# Altium project DPT2.3.PrjPcb
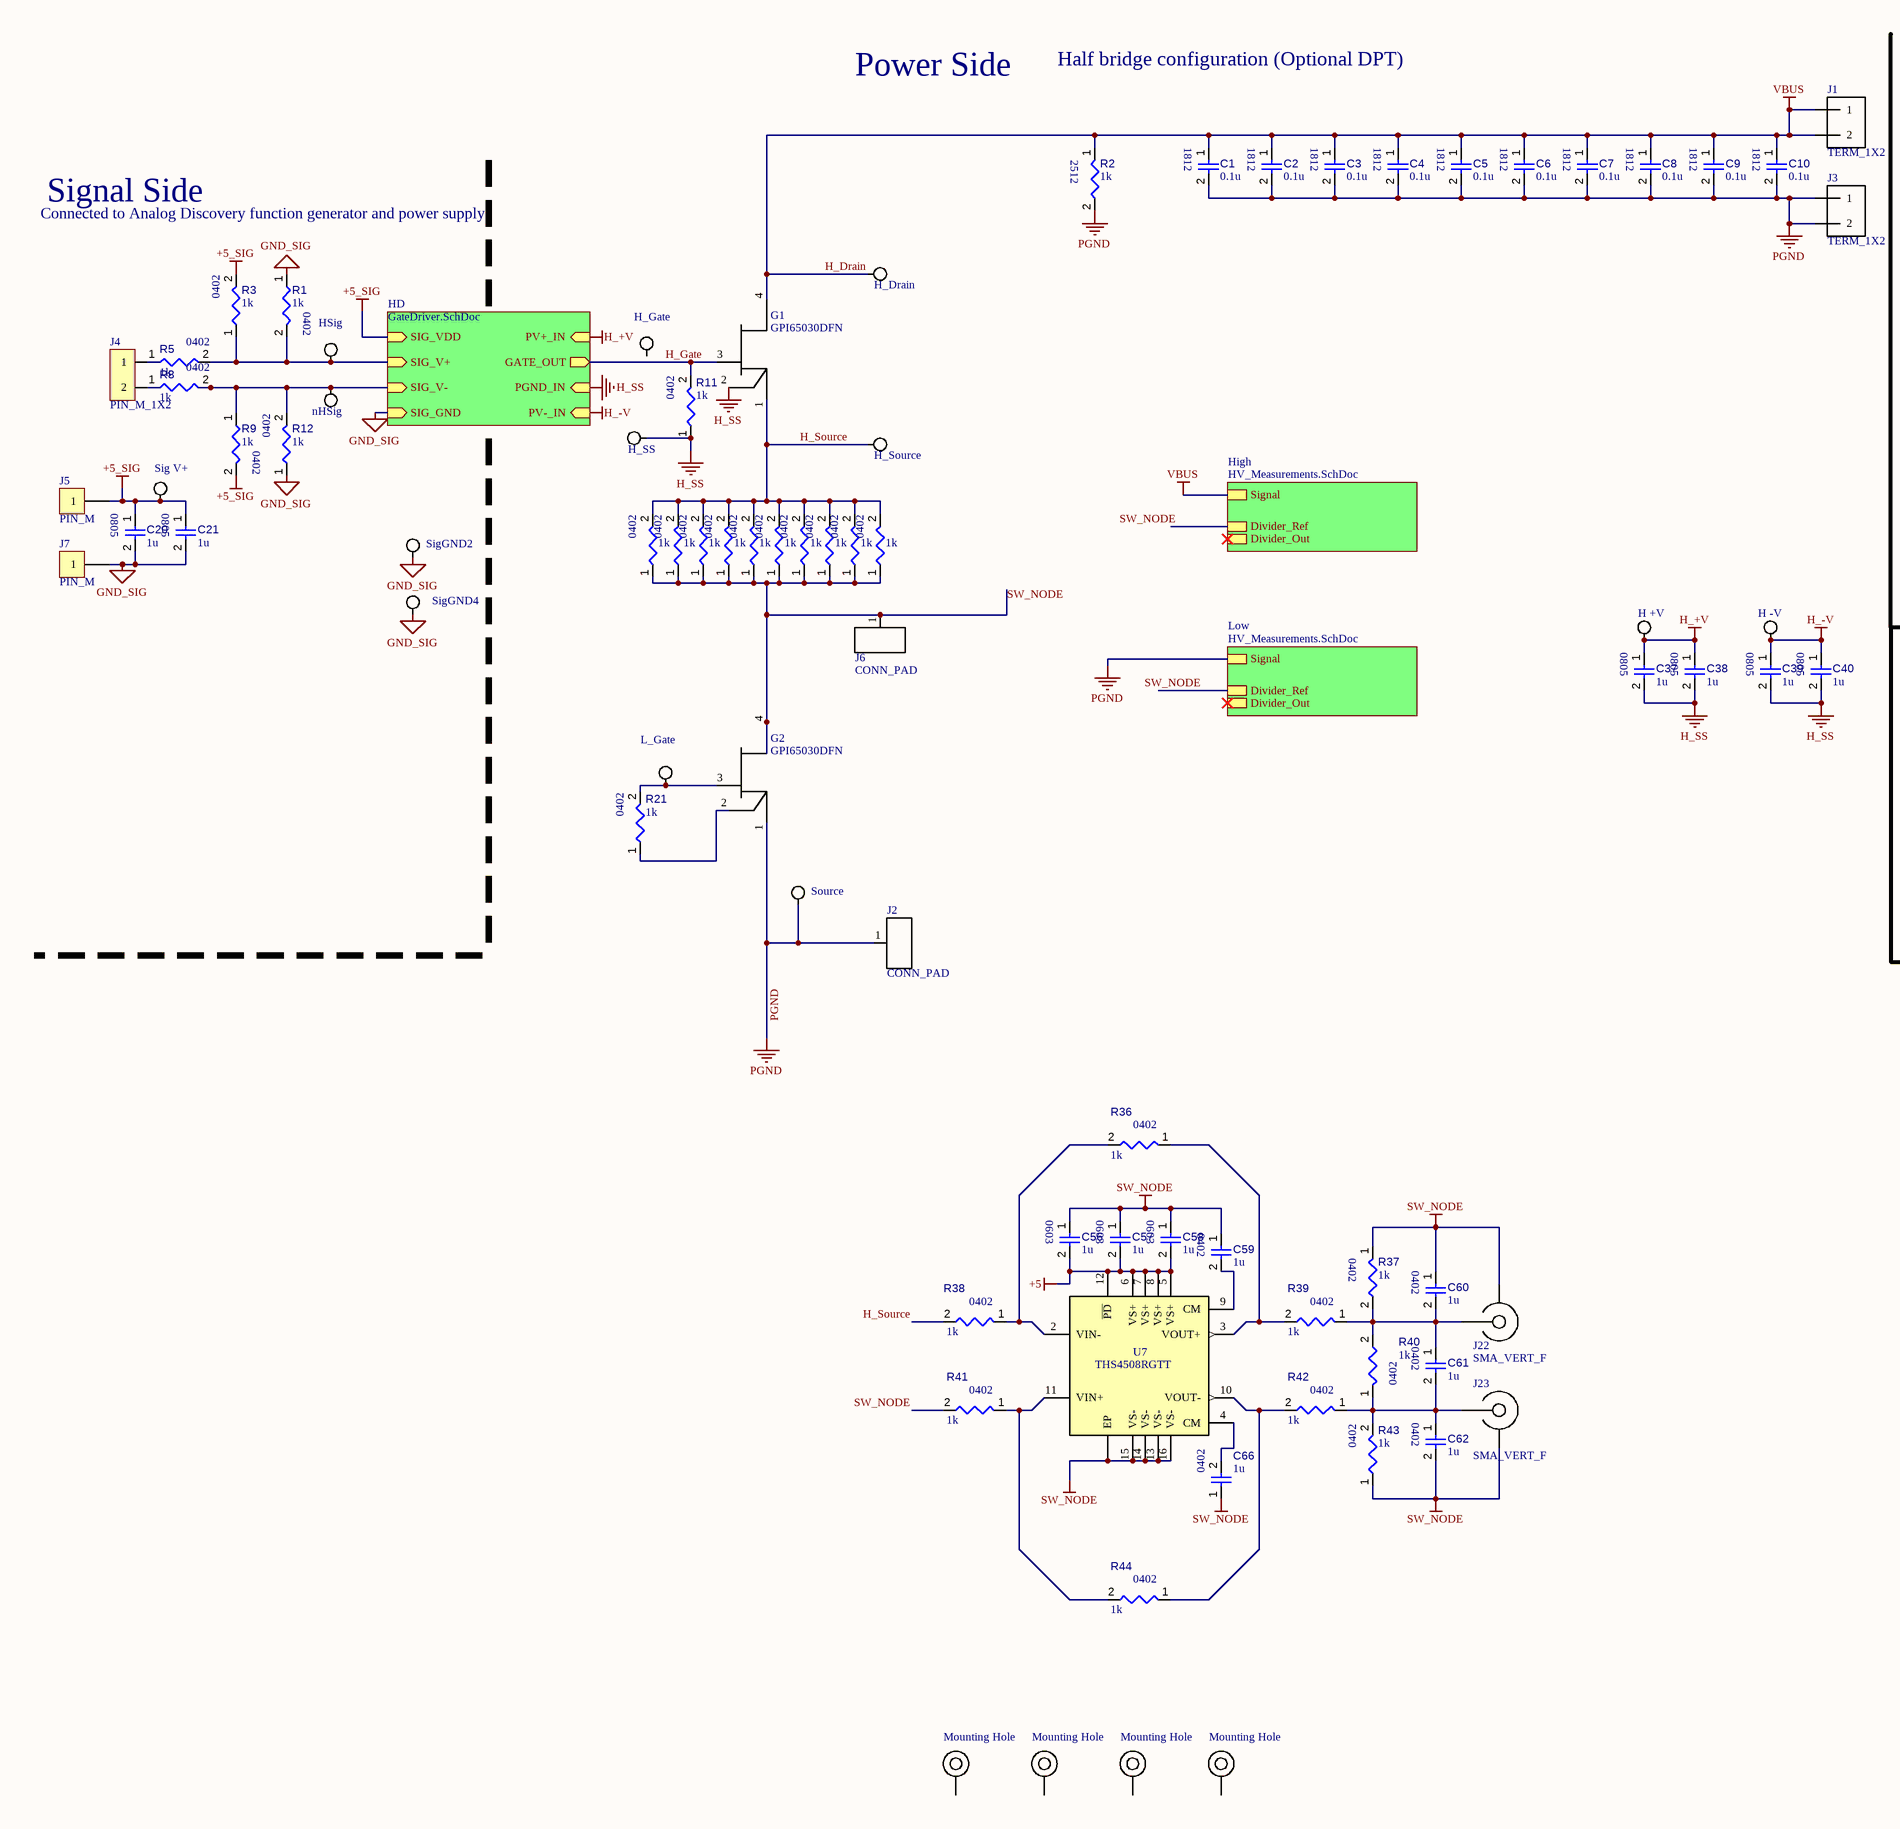
[diagram p0: DPT2.3.SchDoc, left]
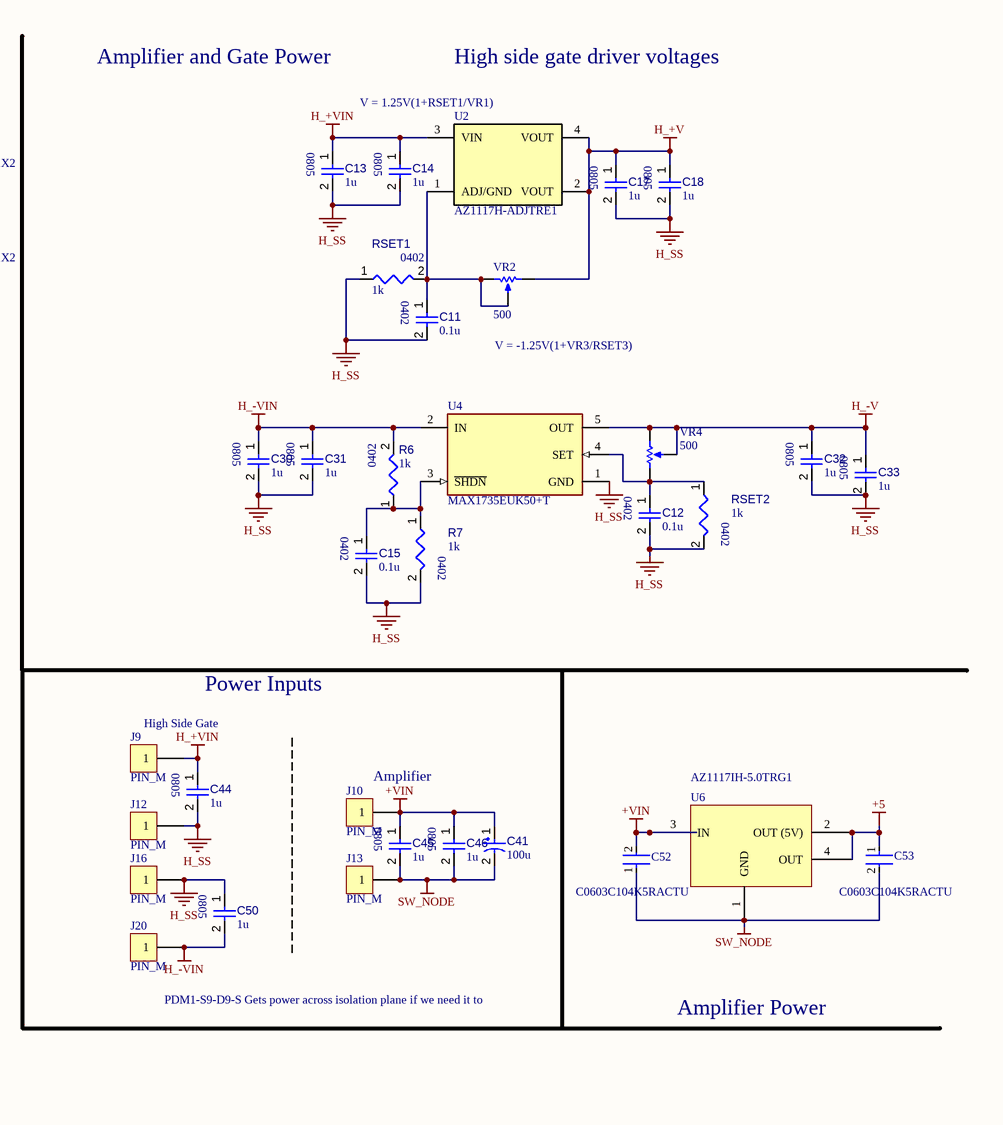
[diagram p1: DPT2.3.SchDoc, right]
3 sheets, 139 parts. Net scope: hierarchical (ports join the sheet entries above them; power ports are global).
Board file: DPT2.3.PcbDoc
Sheets:
  DPT2.3.SchDoc
    High = HV_Measurements.SchDoc
    Low = HV_Measurements.SchDoc
    HD = GateDriver.SchDoc

## Sheet DPT2.3.SchDoc
size A2; SheetNumber: 1; SheetTotal: 3

### Parts
C1  value 0.1u  [CAP_1812]  (hidden comment: CAP-1812)
C2  value 0.1u  [CAP_1812]  (hidden comment: CAP-1812)
C3  value 0.1u  [CAP_1812]  (hidden comment: CAP-1812)
C4  value 0.1u  [CAP_1812]  (hidden comment: CAP-1812)
C5  value 0.1u  [CAP_1812]  (hidden comment: CAP-1812)
C6  value 0.1u  [CAP_1812]  (hidden comment: CAP-1812)
C7  value 0.1u  [CAP_1812]  (hidden comment: CAP-1812)
C8  value 0.1u  [CAP_1812]  (hidden comment: CAP-1812)
C9  value 0.1u  [CAP_1812]  (hidden comment: CAP-1812)
C10  value 0.1u  [CAP_1812]  (hidden comment: CAP-1812)
C11  value 0.1u  [CAP_0402_HIGH]  (hidden comment: CAP-0402)
C12  value 0.1u  [CAP_0402_HIGH]  (hidden comment: CAP-0402)
C13  value 1u  [CAP_0805_MED]  (hidden comment: CAP-0805)
C14  value 1u  [CAP_0805_MED]  (hidden comment: CAP-0805)
C15  value 0.1u  [CAP_0402_HIGH]  (hidden comment: CAP-0402)
C17  value 1u  [CAP_0805_MED]  (hidden comment: CAP-0805)
C18  value 1u  [CAP_0805_MED]  (hidden comment: CAP-0805)
C20  value 1u  [CAP_0805_MED]  (hidden comment: CAP-0805)
C21  value 1u  [CAP_0805_MED]  (hidden comment: CAP-0805)
C30  value 1u  [CAP_0805_MED]  (hidden comment: CAP-0805)
C31  value 1u  [CAP_0805_MED]  (hidden comment: CAP-0805)
C32  value 1u  [CAP_0805_MED]  (hidden comment: CAP-0805)
C33  value 1u  [CAP_0805_MED]  (hidden comment: CAP-0805)
C37  value 1u  [CAP_0805_MED]  (hidden comment: CAP-0805)
C38  value 1u  [CAP_0805_MED]  (hidden comment: CAP-0805)
C39  value 1u  [CAP_0805_MED]  (hidden comment: CAP-0805)
C40  value 1u  [CAP_0805_MED]  (hidden comment: CAP-0805)
C41  value 100u  [PCAP_2MM_5MM]  (hidden comment: PCAP-2MMx5MM)
C44  value 1u  [CAP_0805_MED]  (hidden comment: CAP-0805)
C45  value 1u  [CAP_0805_MED]  (hidden comment: CAP-0805)
C46  value 1u  [CAP_0805_MED]  (hidden comment: CAP-0805)
C50  value 1u  [CAP_0805_MED]  (hidden comment: CAP-0805)
C52  C0603C104K5RACTU  [FP-C0603C-CF-IPC_B]
C53  C0603C104K5RACTU  [FP-C0603C-CF-IPC_B]
C56  value 1u  [CAP_0603_HIGH]  (hidden comment: CAP-0603)
C57  value 1u  [CAP_0603_HIGH]  (hidden comment: CAP-0603)
C58  value 1u  [CAP_0603_HIGH]  (hidden comment: CAP-0603)
C59  value 1u  [CAP_0402_HIGH]  (hidden comment: CAP-0402)
C60  value 1u  [CAP_0402_HIGH]  (hidden comment: CAP-0402)
C61  value 1u  [CAP_0402_HIGH]  (hidden comment: CAP-0402)
C62  value 1u  [CAP_0402_HIGH]  (hidden comment: CAP-0402)
C66  value 1u  [CAP_0402_HIGH]  (hidden comment: CAP-0402)
G1  GPI65030DFN  [DFN_8X8]
G2  GPI65030DFN  [DFN_8X8]
H_+V  Testpoint  [Testpoint-Footprint-1]  (value not drawn)
H_-V  Testpoint  [Testpoint-Footprint-1]  (value not drawn)
H_Drain  Testpoint  [Testpoint-Footprint-1]  (value not drawn)
H_Gate  Testpoint  [Testpoint-Footprint-1]  (value not drawn)
H_Source  Testpoint  [Testpoint-Footprint-1]  (value not drawn)
H_SS  Testpoint  [Testpoint-Footprint-1]  (value not drawn)
HSig  Testpoint  [Testpoint-Footprint-1]  (value not drawn)
J1  TERM_1X2  [J_TERM_BLK_1X2]
J2  CONN_PAD  [CONN_PAD]
J3  TERM_1X2  [J_TERM_BLK_1X2]
J4  PIN_M_1X2  [J_THT_2.54MM_1X2]
J5  PIN_M  [J_THT_1_PIN]
J6  CONN_PAD  [CONN_PAD]
J7  PIN_M  [J_THT_1_PIN]
J9  PIN_M  [J_THT_1_PIN]
J10  PIN_M  [J_THT_1_PIN]
J12  PIN_M  [J_THT_1_PIN]
J13  PIN_M  [J_THT_1_PIN]
J16  PIN_M  [J_THT_1_PIN]
J20  PIN_M  [J_THT_1_PIN]
J22  SMA_VERT_F  [SMA_VERT_F]
J23  SMA_VERT_F  [SMA_VERT_F]
L_Gate  Testpoint  [Testpoint-Footprint-1]  (value not drawn)
MH1  Mounting Hole  [Mounting Hole-Footprint-1]
MH2  Mounting Hole  [Mounting Hole-Footprint-1]
MH3  Mounting Hole  [Mounting Hole-Footprint-1]
MH4  Mounting Hole  [Mounting Hole-Footprint-1]
nHSig  Testpoint  [Testpoint-Footprint-1]  (value not drawn)
R1  value 1k  [RES_0402_HIGH]  (hidden comment: RES-0402)
R2  value 1k  [RES_2512_MED]  (hidden comment: RES-2512)
R3  value 1k  [RES_0402_HIGH]  (hidden comment: RES-0402)
R4  value 1k  [RES_0402_HIGH]  (hidden comment: RES-0402)
R5  value 1k  [RES_0402_HIGH]  (hidden comment: RES-0402)
R6  value 1k  [RES_0402_HIGH]  (hidden comment: RES-0402)
R7  value 1k  [RES_0402_HIGH]  (hidden comment: RES-0402)
R8  value 1k  [RES_0402_HIGH]  (hidden comment: RES-0402)
R9  value 1k  [RES_0402_HIGH]  (hidden comment: RES-0402)
R10  value 1k  [RES_0402_HIGH]  (hidden comment: RES-0402)
R11  value 1k  [RES_0402_HIGH]  (hidden comment: RES-0402)
R12  value 1k  [RES_0402_HIGH]  (hidden comment: RES-0402)
R21  value 1k  [RES_0402_HIGH]  (hidden comment: RES-0402)
R23  value 1k  [RES_0402_HIGH]  (hidden comment: RES-0402)
R25  value 1k  [RES_0402_HIGH]  (hidden comment: RES-0402)
R36  value 1k  [RES_0402_HIGH]  (hidden comment: RES-0402)
R37  value 1k  [RES_0402_HIGH]  (hidden comment: RES-0402)
R38  value 1k  [RES_0402_HIGH]  (hidden comment: RES-0402)
R39  value 1k  [RES_0402_HIGH]  (hidden comment: RES-0402)
R40  value 1k  [RES_0402_HIGH]  (hidden comment: RES-0402)
R41  value 1k  [RES_0402_HIGH]  (hidden comment: RES-0402)
R42  value 1k  [RES_0402_HIGH]  (hidden comment: RES-0402)
R43  value 1k  [RES_0402_HIGH]  (hidden comment: RES-0402)
R44  value 1k  [RES_0402_HIGH]  (hidden comment: RES-0402)
R45  value 1k  [RES_0402_HIGH]  (hidden comment: RES-0402)
R46  value 1k  [RES_0402_HIGH]  (hidden comment: RES-0402)
R47  value 1k  [RES_0402_HIGH]  (hidden comment: RES-0402)
R49  value 1k  [RES_0402_HIGH]  (hidden comment: RES-0402)
R50  value 1k  [RES_0402_HIGH]  (hidden comment: RES-0402)
R53  value 1k  [RES_0402_HIGH]  (hidden comment: RES-0402)
RSET1  value 1k  [RES_0402_HIGH]  (hidden comment: RES-0402)
RSET2  value 1k  [RES_0402_HIGH]  (hidden comment: RES-0402)
Sig_V+  Testpoint  [Testpoint-Footprint-1]  (value not drawn)
SigGND2  Testpoint  [Testpoint-Footprint-1]  (value not drawn)
SigGND4  Testpoint  [Testpoint-Footprint-1]  (value not drawn)
Source  Testpoint  [Testpoint-Footprint-1]  (value not drawn)
U2  AZ1117H-ADJTRE1  [SOT-223]
U4  MAX1735EUK50+T  [FP-U5-2-IPC_B]
U6  AZ1117IH-5.0TRG1  [SOT230P700X180-4N]
U7  THS4508RGTT  [QFN-16]
VR2  value 500  [TRIM_J-LEAD]  (hidden comment: RES_POT_JLEAD)
VR4  value 500  [TRIM_J-LEAD]  (hidden comment: RES_POT_JLEAD)

### Sub-sheets
HD = GateDriver.SchDoc: GATE_OUT (out), SIG_V+ (in), SIG_V- (in), SIG_GND (in), SIG_VDD (in), PGND_IN (in), PV+_IN (in), PV-_IN (in)
High = HV_Measurements.SchDoc: Divider_Ref, Divider_Out, Signal
Low = HV_Measurements.SchDoc: Divider_Ref, Divider_Out, Signal

### Nets
+5: C53.1 C56.2 C57.2 C58.2 U6.2(OUT_(5V)) U6.4(OUT) U7.5(VS+) U7.6(VS+) U7.7(VS+) U7.8(VS+) U7.12(~{PD})
+5_SIG: C20.1 C21.1 J5.1 R3.2 R9.2 Sig_V+.1 ; sheet HD/SIG_VDD
+VIN: C41.1 C45.1 C46.1 C52.2 J10.1 U6.3(IN)
GND_SIG: C20.2 C21.2 J7.1 R1.1 R12.1 SigGND2.1 SigGND4.1 ; sheet HD/SIG_GND
H_+V: C17.1 C18.1 C37.1 C38.1 H_+V.1 U2.2(VOUT) U2.4(VOUT) VR2.1(CCW) ; sheet HD/PV+_IN
H_+VIN: C13.1 C14.1 C44.1 J9.1 U2.3(VIN)
H_-V: C32.1 C33.1 C39.1 C40.1 H_-V.1 U4.5(OUT) VR4.2(S) VR4.3(CW) ; sheet HD/PV-_IN
H_-VIN: C30.1 C31.1 C50.2 J20.1 R6.2 U4.2(IN)
H_Drain: C1.1 C2.1 C3.1 C4.1 C5.1 C6.1 C7.1 C8.1 C9.1 C10.1 G1.4(D) H_Drain.1 J1.1 J1.2 R2.1 ; sheet High/Signal  [also labelled VBUS]
H_SS: C11.2 C12.2 C13.2 C14.2 C15.2 C17.2 C18.2 C30.2 C31.2 C32.2 C33.2 C37.2 C38.2 C39.2 C40.2 C44.2 C50.1 G1.2(KS) H_SS.1 J12.1 J16.1 R7.2 R11.1 RSET1.1 RSET2.2 U4.1(GND) ; sheet HD/PGND_IN
PGND: C1.2 C2.2 C3.2 C4.2 C5.2 C6.2 C7.2 C8.2 C9.2 C10.2 G2.1(S) J2.1 J3.1 J3.2 R2.2 Source.1 ; sheet Low/Signal
SW_NODE: C41.2 C45.2 C46.2 C52.1 C53.2 C56.1 C57.1 C58.1 C59.1 C60.1 C62.2 C66.1 G2.4(D) J6.1 J13.1 J22.2 J23.2 R4.1 R10.1 R23.1 R25.1 R37.1 R41.2 R43.1 R45.1 R46.1 R47.1 R49.1 R50.1 R53.1 U6.1(GND) U7.13(VS-) U7.14(VS-) U7.15(VS-) U7.16(VS-) U7.17(EP) ; sheet High/Divider_Ref, sheet Low/Divider_Ref
H_Gate: G1.3(G) R11.2 ; sheet HD/GATE_OUT
H_Source: G1.1(S) H_Source.1 R4.2 R10.2 R23.2 R25.2 R38.2 R45.2 R46.2 R47.2 R49.2 R50.2 R53.2
NetC11_1: C11.1 RSET1.2 U2.1(ADJ/GND) VR2.2(S) VR2.3(CW)
NetC12_1: C12.1 RSET2.1 U4.4(SET) VR4.1(CCW)
NetC15_1: C15.1 R6.1 R7.1 U4.3(~{SHDN})
NetC59_2: C59.2 U7.9(CM)
NetC60_2: C60.2 C61.1 J22.1 R37.2 R39.1 R40.2
NetC61_2: C61.2 C62.1 J23.1 R40.1 R42.1 R43.2
NetC66_2: C66.2 U7.4(CM)
NetG2_2: G2.2(KS) R21.1
NetG2_3: G2.3(G) L_Gate.1 R21.2
NetHSig_1: HSig.1 R1.2 R3.1 R5.2 ; sheet HD/SIG_V+
NetJ4_1: J4.1 R5.1
NetJ4_2: J4.2 R8.1
NetnHSig_1: nHSig.1 R8.2 R9.1 R12.2 ; sheet HD/SIG_V-
NetR36_1: R36.1 R39.2 U7.3(VOUT+)
NetR36_2: R36.2 R38.1 U7.2(VIN-)
NetR41_1: R41.1 R44.2 U7.11(VIN+)
NetR42_2: R42.2 R44.1 U7.10(VOUT-)

Not connected (* = marked no-connect by the designer): H_Gate 1; MH1 1(GND); MH2 1(GND); MH3 1(GND); MH4 1(GND)

### Notes on the sheet
- Power Side
- Half bridge configuration (Optional DPT)
- Amplifier and Gate Power
- (near U2) V = 1.25V(1+RSET1/VR1)
- High side gate driver voltages
- Connected to Analog Discovery function generator and power supply
- Signal Side
- V = -1.25V(1+VR3/RSET3)
- Power Inputs
- (near J9) High Side Gate
- (near J10) Amplifier
- PDM1-S9-D9-S Gets power across isolation plane if we need it to
- Amplifier Power

### Library data of the parts
C1-C10 = CMP-001-00088-2: Non polarized SMD capacitor - 1812 (4532 Metric); Package: 1812
C11 C12 C15 C59-C62 C66 = CMP-001-00083-3: Non polarized SMD capacitor - 0402 (1005 Metric); Package: 0402
C13 C14 C17 C18 C20 C21 C30-C33 C37-C40 C44-C46 C50 = CMP-001-00086-3: Non polarized SMD capacitor - 0805 (1608 Metric); Package: 0805
C41 = CMP-001-00091-1: Polarized THT capacitor - Radial can, 2mm lead spacing, 5mm diameter
C52 C53 = CMP-2006-03061-2: CAP CER 0.1UF 50V X7R 0603; Manufacturer: KEMET; Tolerance: 0.1; Temperature Coefficient: 30ppm/°C; Material: Ceramic; Automotive Grade: Grade 1; Value: 0.10 μF; Temperature: -55°C to +125°C; RoHS: TRUE; Temperature Range High: +125°C; Lead Free: Yes; Octopart: https://octopart.com/c0603c104k5ractu-kemet-139244; Digikey Description: CAP CER 0.1UF 50V X7R 0603; Category: Cap; Package: C0603C-CF; ComponentLink2Description: Datasheet; Temperature Range Low: -55°C; Device Class L1: Passive Components; Voltage Rating: 50 V; Automotive: Yes; Device Class L3: Ceramic Capacitors; ComponentLink2URL: https://api.kemet.com/component-edge/download/datasheet/C0603C100J5GACAUTO.pdf; Capacitance: 0.10 μF; Device Class L2: Capacitors; Manufacturer Part Number: C0603C104K5RACTU; Temperature Characteristic: X7R; Height: 0.87mm
C56-C58 = CMP-001-00084-2: Non polarized SMD capacitor - 0603 (1608 Metric); Package: 0603
G1 G2 = CMP-023-000000-5: 650V 15A GaN Enhancement mode Transistor; pin to pad: 1>1+2+9 2>3 3>4 4>5+6+7+8; Package: DFN8X8
H_+V H_-V H_Drain H_Gate H_Source H_SS HSig L_Gate nHSig Sig_V+ SigGND2 SigGND4 Source = CMP-001-0000-5: testpoint for circuit
J1 J3 = CMP-002-00071-1: Terminal Block 1X2, 6.35mm pitch
J2 J6 = CMP-002-00074-4: Solderable Connection Pad
J4 = CMP-002-00073-2: Male Pin 2.54mm pitch 1X2
J5 J7 J9 J10 J12 J13 J16 J20 = CMP-002-00072-1: Male Pin, 1 Pin
J22 J23 = CMP-025-000000-6: SMA connector, Vertical, Female; pin to pad: 2>2+3+4+5; Package: SMA
MH1-MH4 = CMP-032-000006-1
R1 R3-R12 R21 R23 R25 R36-R47 R49 R50 R53 RSET1 RSET2 = CMP-009-00177-2: SMD Resistor - 0402 (1005 Metric); Package: 0402
R2 = CMP-009-00182-3: SMD Resistor - 2512 (6432 Metric); Package: 2512
U2 = CMP-019-00050-1: IC REG LINEAR POS ADJ 1A SOT223; Package: SOT223
U4 = CMP-05721-000044-1: IC REG LIN NEG ADJ 200MA SOT23-5
U6 = CMP-032-000005-2: https://www.digikey.ca/en/products/detail/diodes-incorporated/AZ1117IH-5-0TRG1/5699673
U7 = CMP-027-000000-11: WIDEBAND, LOW NOISE, LOW DISTORTION FULLY DIFFERENTIAL AMPLIFIER; pin to pad: 17>17+18+19+20+21; Package: QFN3X3
VR2 VR4 = CMP-009-00181-2: Potentiometer, J-Lead Trim Pot; pin to pad: 2>3 3>2

## Sheet HV_Measurements.SchDoc
size A4; SheetNumber: 3; SheetTotal: 3
Used 2 times, as channels High, Low. Parts and nets are listed once, with the designators drawn on the sheet.
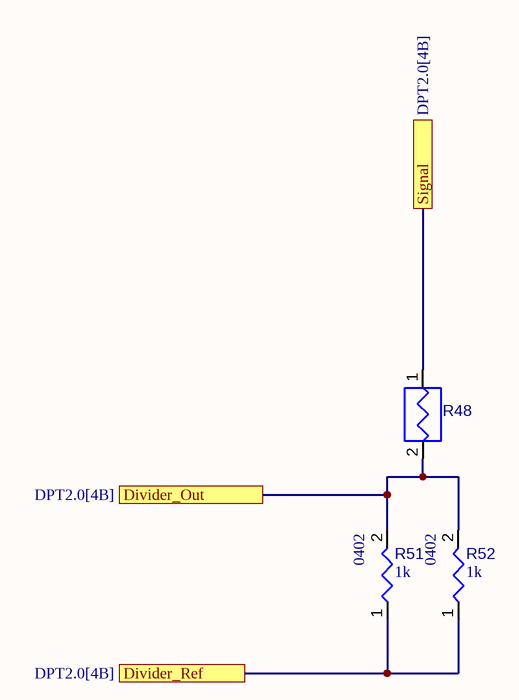
[diagram p2: HV_Measurements.SchDoc]

### Parts
R48  RES-2512-SIDE  [RES_2512_SIDE]  (value not drawn)
R51  value 1k  [RES_0402_HIGH]  (hidden comment: RES-0402)
R52  value 1k  [RES_0402_HIGH]  (hidden comment: RES-0402)

### Ports
Divider_Out (see DPT2.0[4B]), Divider_Ref (see DPT2.0[4B]), Signal (see DPT2.0[4B])

### Nets
Divider_Out: R48.2 R51.2 R52.2 ; port Divider_Out
Divider_Ref: R51.1 R52.1 ; port Divider_Ref
Signal: R48.1 ; port Signal

### Channels
High: designators end in High; ports Divider_Out=NetR48High_2 Divider_Ref=SW_NODE Signal=H_Drain
Low: designators end in Low; ports Divider_Out=NetR48Low_2 Divider_Ref=SW_NODE Signal=PGND

### Library data of the parts
R48 = CMP-009-00183-1: SMD Resistor - 2512 (6432) On It's Side; Package: 2512
R51 R52 = CMP-009-00177-2: SMD Resistor - 0402 (1005 Metric); Package: 0402

## Sheet GateDriver.SchDoc
size A4; SheetNumber: 2; SheetTotal: 3
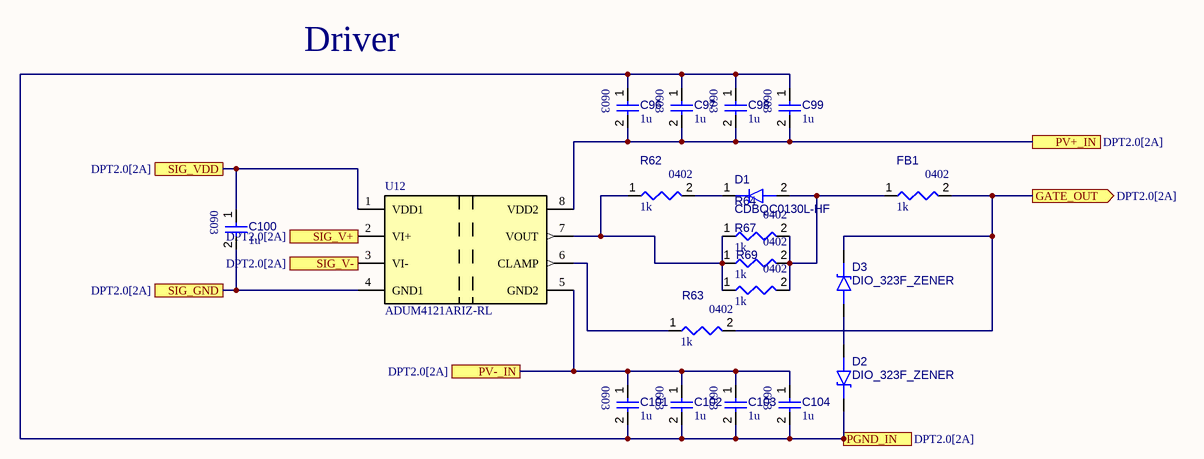
[diagram p3: GateDriver.SchDoc]

### Parts
C96  value 1u  [CAP_0603_HIGH]  (hidden comment: CAP-0603)
C97  value 1u  [CAP_0603_HIGH]  (hidden comment: CAP-0603)
C98  value 1u  [CAP_0603_HIGH]  (hidden comment: CAP-0603)
C99  value 1u  [CAP_0603_HIGH]  (hidden comment: CAP-0603)
C100  value 1u  [CAP_0603_HIGH]  (hidden comment: CAP-0603)
C101  value 1u  [CAP_0603_HIGH]  (hidden comment: CAP-0603)
C102  value 1u  [CAP_0603_HIGH]  (hidden comment: CAP-0603)
C103  value 1u  [CAP_0603_HIGH]  (hidden comment: CAP-0603)
C104  value 1u  [CAP_0603_HIGH]  (hidden comment: CAP-0603)
D1  CDBQC0130L-HF  [DIO_SOD-923F]
D2  DIO_323F_ZENER  [DIO_SOD-323F]
D3  DIO_323F_ZENER  [DIO_SOD-323F]
FB1  value 1k  [RES_0402_HIGH]  (hidden comment: RES-0402)
R62  value 1k  [RES_0402_HIGH]  (hidden comment: RES-0402)
R63  value 1k  [RES_0402_HIGH]  (hidden comment: RES-0402)
R64  value 1k  [RES_0402_HIGH]  (hidden comment: RES-0402)
R67  value 1k  [RES_0402_HIGH]  (hidden comment: RES-0402)
R69  value 1k  [RES_0402_HIGH]  (hidden comment: RES-0402)
U12  ADUM4121ARIZ-RL  [SOIC-8_WIDE]

### Ports
GATE_OUT (out, see DPT2.0[2A]), PGND_IN (see DPT2.0[2A]), PV+_IN (see DPT2.0[2A]), PV-_IN (see DPT2.0[2A]), SIG_GND (see DPT2.0[2A]), SIG_V+ (in, see DPT2.0[2A]), SIG_V- (in, see DPT2.0[2A]), SIG_VDD (see DPT2.0[2A])

### Nets
+5_SIG: C100.1 U12.1(VDD1) ; port SIG_VDD
GND_SIG: C100.2 U12.4(GND1) ; port SIG_GND
H_+V: C96.2 C97.2 C98.2 C99.2 U12.8(VDD2) ; port PV+_IN
H_-V: C101.1 C102.1 C103.1 C104.1 U12.5(GND2) ; port PV-_IN
H_SS: C96.1 C97.1 C98.1 C99.1 C101.2 C102.2 C103.2 C104.2 D2.1(K) ; port PGND_IN
H_Gate: D3.1(K) FB1.2 R63.2 ; port GATE_OUT
NetD1_1: D1.1(K) R62.2
NetD1_2: D1.2(A) FB1.1 R64.2 R67.2 R69.2
NetD2_2: D2.2(A) D3.2(A)
NetHSig_1: U12.2(VI+) ; port SIG_V+
NetnHSig_1: U12.3(VI-) ; port SIG_V-
NetR62_1: R62.1 R64.1 R67.1 R69.1 U12.7(VOUT)
NetR63_1: R63.1 U12.6(CLAMP)

### Notes on the sheet
- Driver

### Library data of the parts
C96-C104 = CMP-001-00084-2: as C56 on sheet DPT2.3; Package: 0603
D1 = CMP-004-00031-2: Low VF SMD Schottky Barrier Diode; Package: SOD-923F
D2 D3 = CMP-004-00032-1: Generic SOD-323F Zener diode; Value: 6.2V; Package: SOD-323F
FB1 R62-R64 R67 R69 = CMP-009-00177-2: SMD Resistor - 0402 (1005 Metric); Package: 0402
U12 = CMP-019-000000-4: DGTL ISO 5KV 1CH GATE DRVR 8SOIC; Package: 8-SOIC WIDE

## Nets that join several sheets
+5_SIG: DPT2.3 (6 pins), GateDriver (C100.1 U12.1)
GND_SIG: DPT2.3 (7 pins), GateDriver (C100.2 U12.4)
H_+V: DPT2.3 (8 pins), GateDriver (5 pins)
H_-V: DPT2.3 (8 pins), GateDriver (5 pins)
H_Drain: DPT2.3 (15 pins), High (R48High.1)
H_SS: DPT2.3 (26 pins), GateDriver (9 pins)
PGND: DPT2.3 (16 pins), Low (R48Low.1)
SW_NODE: DPT2.3 (36 pins), High (R51High.1 R52High.1), Low (R51Low.1 R52Low.1)
H_Gate: DPT2.3 (G1.3 R11.2), GateDriver (D3.1 FB1.2 R63.2)
NetHSig_1: DPT2.3 (HSig.1 R1.2 R3.1 R5.2), GateDriver (U12.2)
NetnHSig_1: DPT2.3 (nHSig.1 R8.2 R9.1 R12.2), GateDriver (U12.3)